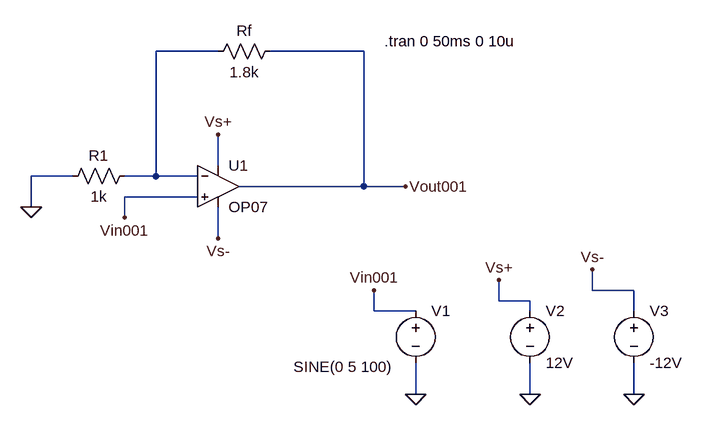
[diagram p0: schematic Task02.asc]
Task02.asc, the LTspice schematic file:
Version 4
SHEET 1 880 680
WIRE 160 -96 64 -96
WIRE 384 -96 240 -96
WIRE 160 80 160 32
WIRE -64 96 -128 96
WIRE 64 96 64 -96
WIRE 64 96 16 96
WIRE 128 96 64 96
WIRE 384 112 384 -96
WIRE 384 112 192 112
WIRE 448 112 384 112
WIRE 128 128 16 128
WIRE -128 144 -128 96
WIRE 16 160 16 128
WIRE 160 192 160 144
WIRE 736 272 736 240
WIRE 800 272 736 272
WIRE 592 288 592 256
WIRE 640 288 592 288
WIRE 400 304 400 272
WIRE 464 304 400 304
WIRE 640 304 640 288
WIRE 800 304 800 272
WIRE 464 432 464 384
WIRE 640 432 640 384
WIRE 800 432 800 384
FLAG 16 160 Vin001
FLAG -128 144 0
FLAG 160 32 Vs+
FLAG 160 192 Vs-
FLAG 448 112 Vout001
FLAG 464 432 0
FLAG 640 432 0
FLAG 800 432 0
FLAG 400 272 Vin001
FLAG 592 256 Vs+
FLAG 736 240 Vs-
SYMBOL OpAmps\\OP07 160 48 R0
SYMATTR InstName U1
SYMBOL res -80 112 R270
WINDOW 0 32 56 VTop 2
WINDOW 3 0 56 VBottom 2
SYMATTR InstName R1
SYMATTR Value 1k
SYMBOL res 144 -80 R270
WINDOW 0 32 56 VTop 2
WINDOW 3 0 56 VBottom 2
SYMATTR InstName Rf
SYMATTR Value 1.8k
SYMBOL voltage 464 288 R0
WINDOW 3 -188 102 Left 2
WINDOW 123 0 0 Left 0
WINDOW 39 0 0 Left 0
SYMATTR InstName V1
SYMATTR Value SINE(0 5 100)
SYMBOL voltage 640 288 R0
SYMATTR InstName V2
SYMATTR Value 12V
SYMBOL voltage 800 288 R0
SYMATTR InstName V3
SYMATTR Value -12V
TEXT 416 -112 Left 2 !.tran 0 50ms 0 10u

The netlist it stands for:
* Task02.asc
XU1 Vin001 N001 Vs+ Vs- Vout001 LT1001  ; OP07, pins In+ In- V+ V- OUT
R1 0 N001 1k
Rf N001 Vout001 1.8k
V1 Vin001 0 SINE(0 5 100)
V2 Vs+ 0 12V
V3 Vs- 0 -12V
.tran 0 50ms 0 10u
.lib LTC.lib
.backanno
.end

* Results of the author's LTspice run, read from the files saved beside the schematic
* Operating Point, zero values left out:
*   V(vs+) = 12 V
*   V(vs-) = -12 V
*   I(V3) = 2.25 mA
*   I(V2) = -2.25 mA
*   Ix(u1:3) = 2.25 mA
*   Ix(u1:4) = -2.25 mA
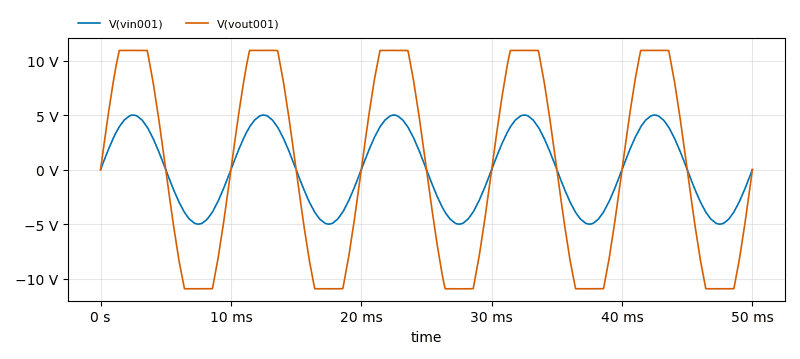
[diagram p1: Transient Analysis of Task02.asc, plotted from the saved traces]
* Transient Analysis, 1 run:
*   V(vin001): min -5 V, max 5 V, average 311.7 µV, rms 3.536 V, last 0 V
*   V(vout001): min -10.93 V, max 10.94 V, average 691.1 µV, rms 8.784 V, last -4.648 mV